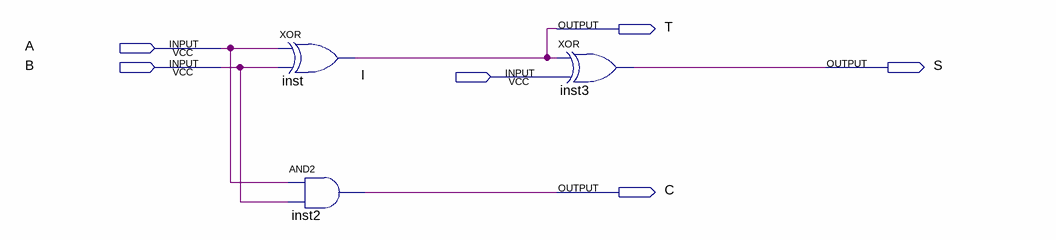
[diagram p0: schematic sheet]
// Quartus schematic nadder_1b.bdf as structural Verilog: 3 symbols, 6 pins
module nadder_1b (
  input  A,
  input  B,
  input  I,
  output T,
  output S,
  output C
);

  xor inst (T, A, B);
  and inst2 (C, A, B);
  xor inst3 (S, T, I);
endmodule
